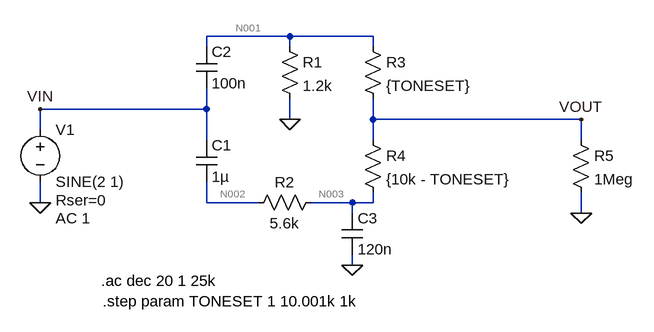
[diagram p0: schematic tone.asc]
tone.asc, the LTspice schematic file:
Version 4
SHEET 1 880 680
WIRE 192 16 64 16
WIRE 320 16 192 16
WIRE 64 32 64 16
WIRE 192 32 192 16
WIRE 320 32 320 16
WIRE 64 128 64 96
WIRE 64 128 -192 128
WIRE 192 144 192 112
WIRE 320 144 320 112
WIRE 640 144 320 144
WIRE -192 160 -192 128
WIRE 64 176 64 128
WIRE 320 176 320 144
WIRE 640 176 640 144
WIRE -192 272 -192 240
WIRE 64 272 64 240
WIRE 144 272 64 272
WIRE 288 272 224 272
WIRE 320 272 320 256
WIRE 320 272 288 272
WIRE 288 288 288 272
WIRE 640 288 640 256
WIRE 288 368 288 352
FLAG 288 368 0
FLAG -192 272 0
FLAG 192 144 0
FLAG 640 288 0
FLAG 640 144 VOUT
FLAG -192 128 VIN
SYMBOL cap 48 176 R0
SYMATTR InstName C1
SYMATTR Value 1µ
SYMBOL cap 48 32 R0
SYMATTR InstName C2
SYMATTR Value 100n
SYMBOL res 240 256 R90
WINDOW 0 0 56 VBottom 2
WINDOW 3 32 56 VTop 2
SYMATTR InstName R2
SYMATTR Value 5.6k
SYMBOL cap 272 288 R0
SYMATTR InstName C3
SYMATTR Value 120n
SYMBOL voltage -192 144 R0
WINDOW 123 24 152 Left 2
WINDOW 39 24 124 Left 2
SYMATTR InstName V1
SYMATTR Value SINE(2 1)
SYMATTR Value2 AC 1
SYMATTR SpiceLine Rser=0
SYMBOL res 304 16 R0
SYMATTR InstName R3
SYMATTR Value {TONESET}
SYMBOL res 304 160 R0
SYMATTR InstName R4
SYMATTR Value {10k - TONESET}
SYMBOL res 176 16 R0
SYMATTR InstName R1
SYMATTR Value 1.2k
SYMBOL res 624 160 R0
SYMATTR InstName R5
SYMATTR Value 1Meg
TEXT -98 392 Left 2 !.ac dec 20 1 25k
TEXT -96 424 Left 2 !.step param TONESET 1 10.001k 1k

The netlist it stands for:
* tone.asc
C1 VIN N002 1µ
C2 N001 VIN 100n
R2 N003 N002 5.6k
C3 N003 0 120n
V1 VIN 0 SINE(2 1) AC 1 Rser=0
R3 N001 VOUT {TONESET}
R4 VOUT N003 {10k - TONESET}
R1 N001 0 1.2k
R5 VOUT 0 1Meg
.ac dec 20 1 25k
.step param TONESET 1 10.001k 1k
.backanno
.end

* Results of the author's LTspice run, read from the files saved beside the schematic
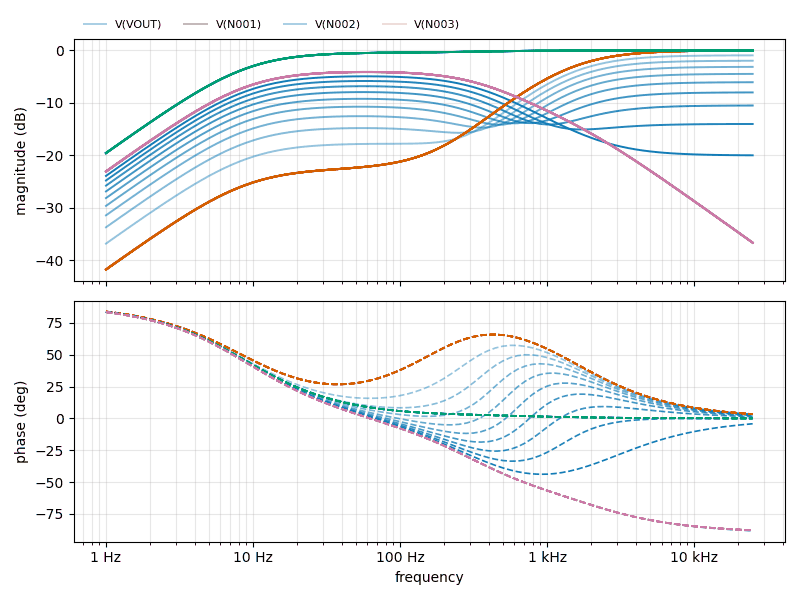
[diagram p1: AC Analysis of tone.asc, plotted from the saved traces]
* AC Analysis, 11 runs:
*   V(VOUT) [toneset=1]: -41.68 dB at 1 Hz, -0.02 dB at 25 kHz, peak -0.02 dB at 25 kHz, 3 dB below the peak at 1.54 kHz
*   V(VOUT) [toneset=1001]: -36.80 dB at 1 Hz, -0.94 dB at 25 kHz, peak -0.94 dB at 25 kHz, 3 dB below the peak at 1.565 kHz
*   V(VOUT) [toneset=2001]: -33.69 dB at 1 Hz, -1.97 dB at 25 kHz, peak -1.97 dB at 25 kHz, 3 dB below the peak at 1.592 kHz
*   V(VOUT) [toneset=3001]: -31.41 dB at 1 Hz, -3.13 dB at 25 kHz, peak -3.13 dB at 25 kHz, 3 dB below the peak at 1.623 kHz
*   V(VOUT) [toneset=4001]: -29.62 dB at 1 Hz, -4.48 dB at 25 kHz, peak -4.48 dB at 25 kHz, 3 dB below the peak at 1.653 kHz
*   V(VOUT) [toneset=5001]: -28.13 dB at 1 Hz, -6.06 dB at 25 kHz, peak -6.06 dB at 25 kHz, 3 dB below the peak at 1.673 kHz
*   V(VOUT) [toneset=6001]: -26.86 dB at 1 Hz, -8.00 dB at 25 kHz, peak -7.94 dB at 56.23 Hz, 3 dB below the peak at 8.58 Hz and 352.8 Hz
*   V(VOUT) [toneset=7001]: -25.76 dB at 1 Hz, -10.50 dB at 25 kHz, peak -6.82 dB at 56.23 Hz, 3 dB below the peak at 8.601 Hz and 366.1 Hz
*   V(N001) [toneset=1]: -41.69 dB at 1 Hz, -0.02 dB at 25 kHz, peak -0.02 dB at 25 kHz, 3 dB below the peak at 1.54 kHz
*   V(N001) [toneset=1001]: -41.70 dB at 1 Hz, -0.02 dB at 25 kHz, peak -0.02 dB at 25 kHz, 3 dB below the peak at 1.54 kHz
*   V(N001) [toneset=2001]: -41.70 dB at 1 Hz, -0.02 dB at 25 kHz, peak -0.02 dB at 25 kHz, 3 dB below the peak at 1.539 kHz
*   V(N001) [toneset=3001]: -41.71 dB at 1 Hz, -0.02 dB at 25 kHz, peak -0.02 dB at 25 kHz, 3 dB below the peak at 1.539 kHz
*   V(N001) [toneset=4001]: -41.72 dB at 1 Hz, -0.02 dB at 25 kHz, peak -0.02 dB at 25 kHz, 3 dB below the peak at 1.539 kHz
*   V(N001) [toneset=5001]: -41.73 dB at 1 Hz, -0.02 dB at 25 kHz, peak -0.02 dB at 25 kHz, 3 dB below the peak at 1.539 kHz
*   V(N001) [toneset=6001]: -41.74 dB at 1 Hz, -0.02 dB at 25 kHz, peak -0.02 dB at 25 kHz, 3 dB below the peak at 1.539 kHz
*   V(N001) [toneset=7001]: -41.74 dB at 1 Hz, -0.02 dB at 25 kHz, peak -0.02 dB at 25 kHz, 3 dB below the peak at 1.538 kHz
*   V(N002) [toneset=1]: -19.52 dB at 1 Hz, -0.00 dB at 25 kHz, peak -0.00 dB at 25 kHz, 3 dB below the peak at 9.908 Hz
*   V(N002) [toneset=1001]: -19.52 dB at 1 Hz, -0.00 dB at 25 kHz, peak -0.00 dB at 25 kHz, 3 dB below the peak at 9.91 Hz
*   V(N002) [toneset=2001]: -19.53 dB at 1 Hz, -0.00 dB at 25 kHz, peak -0.00 dB at 25 kHz, 3 dB below the peak at 9.913 Hz
*   V(N002) [toneset=3001]: -19.53 dB at 1 Hz, -0.00 dB at 25 kHz, peak -0.00 dB at 25 kHz, 3 dB below the peak at 9.917 Hz
*   V(N002) [toneset=4001]: -19.54 dB at 1 Hz, -0.00 dB at 25 kHz, peak -0.00 dB at 25 kHz, 3 dB below the peak at 9.922 Hz
*   V(N002) [toneset=5001]: -19.54 dB at 1 Hz, -0.00 dB at 25 kHz, peak -0.00 dB at 25 kHz, 3 dB below the peak at 9.928 Hz
*   V(N002) [toneset=6001]: -19.55 dB at 1 Hz, -0.00 dB at 25 kHz, peak -0.00 dB at 25 kHz, 3 dB below the peak at 9.935 Hz
*   V(N002) [toneset=7001]: -19.56 dB at 1 Hz, -0.00 dB at 25 kHz, peak -0.00 dB at 25 kHz, 3 dB below the peak at 9.943 Hz
*   V(N003) [toneset=1]: -23.01 dB at 1 Hz, -36.62 dB at 25 kHz, peak -4.10 dB at 56.23 Hz, 3 dB below the peak at 8.599 Hz and 424.2 Hz
*   V(N003) [toneset=1001]: -23.02 dB at 1 Hz, -36.62 dB at 25 kHz, peak -4.10 dB at 56.23 Hz, 3 dB below the peak at 8.601 Hz and 424.2 Hz
*   V(N003) [toneset=2001]: -23.02 dB at 1 Hz, -36.62 dB at 25 kHz, peak -4.10 dB at 56.23 Hz, 3 dB below the peak at 8.604 Hz and 424.3 Hz
*   V(N003) [toneset=3001]: -23.03 dB at 1 Hz, -36.62 dB at 25 kHz, peak -4.10 dB at 56.23 Hz, 3 dB below the peak at 8.608 Hz and 424.4 Hz
*   V(N003) [toneset=4001]: -23.03 dB at 1 Hz, -36.62 dB at 25 kHz, peak -4.10 dB at 56.23 Hz, 3 dB below the peak at 8.612 Hz and 424.5 Hz
*   V(N003) [toneset=5001]: -23.04 dB at 1 Hz, -36.63 dB at 25 kHz, peak -4.11 dB at 56.23 Hz, 3 dB below the peak at 8.618 Hz and 424.7 Hz
*   V(N003) [toneset=6001]: -23.05 dB at 1 Hz, -36.62 dB at 25 kHz, peak -4.11 dB at 56.23 Hz, 3 dB below the peak at 8.625 Hz and 424.9 Hz
*   V(N003) [toneset=7001]: -23.06 dB at 1 Hz, -36.62 dB at 25 kHz, peak -4.11 dB at 56.23 Hz, 3 dB below the peak at 8.633 Hz and 425.1 Hz